# EAGLE board mathlep (EAGLE 4.11)
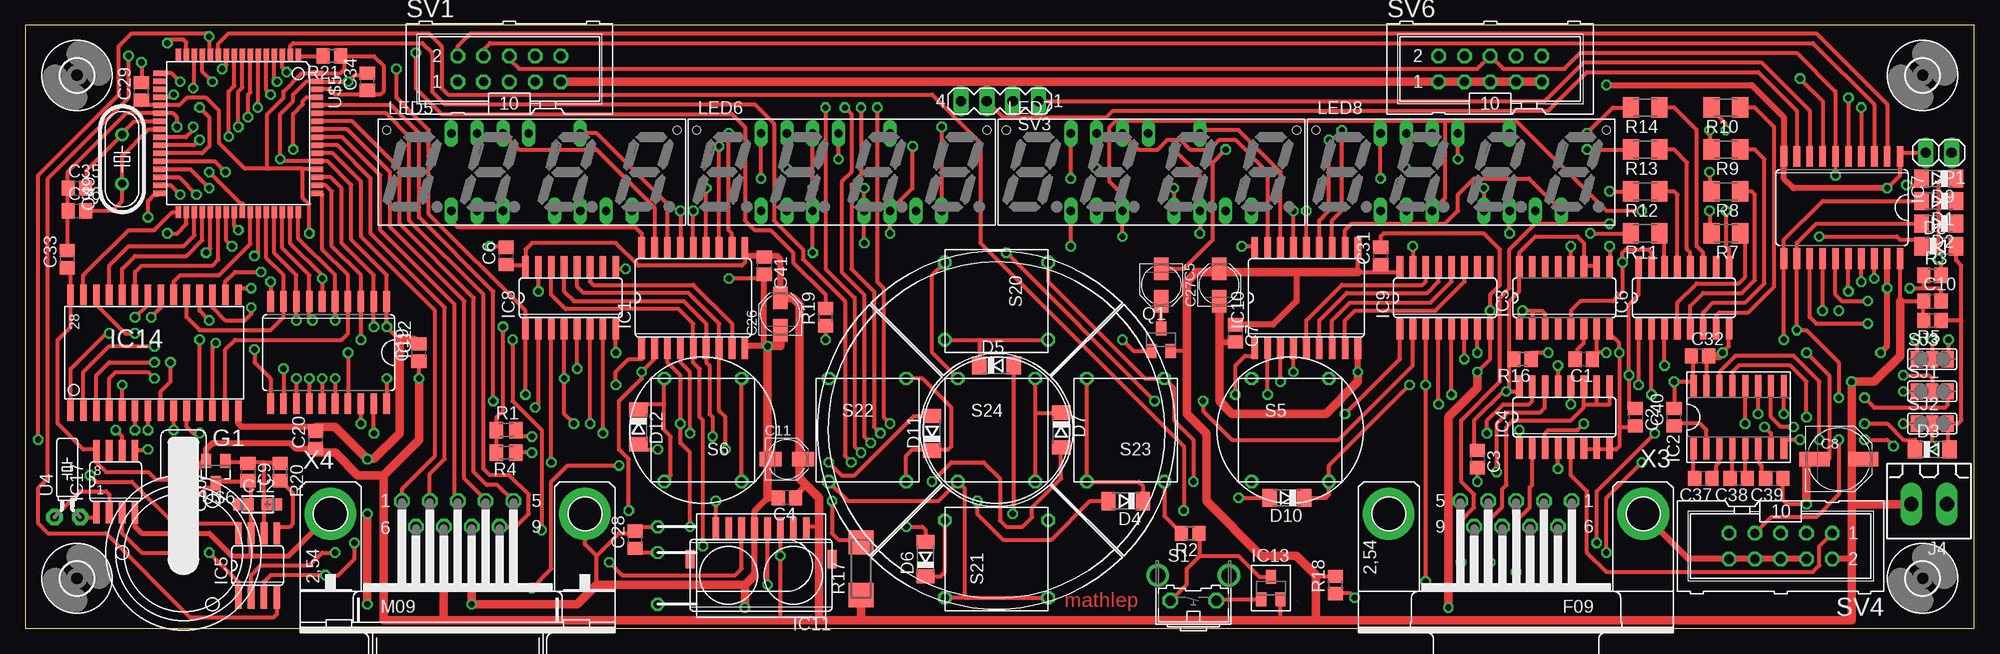
[diagram p3: board, top side]
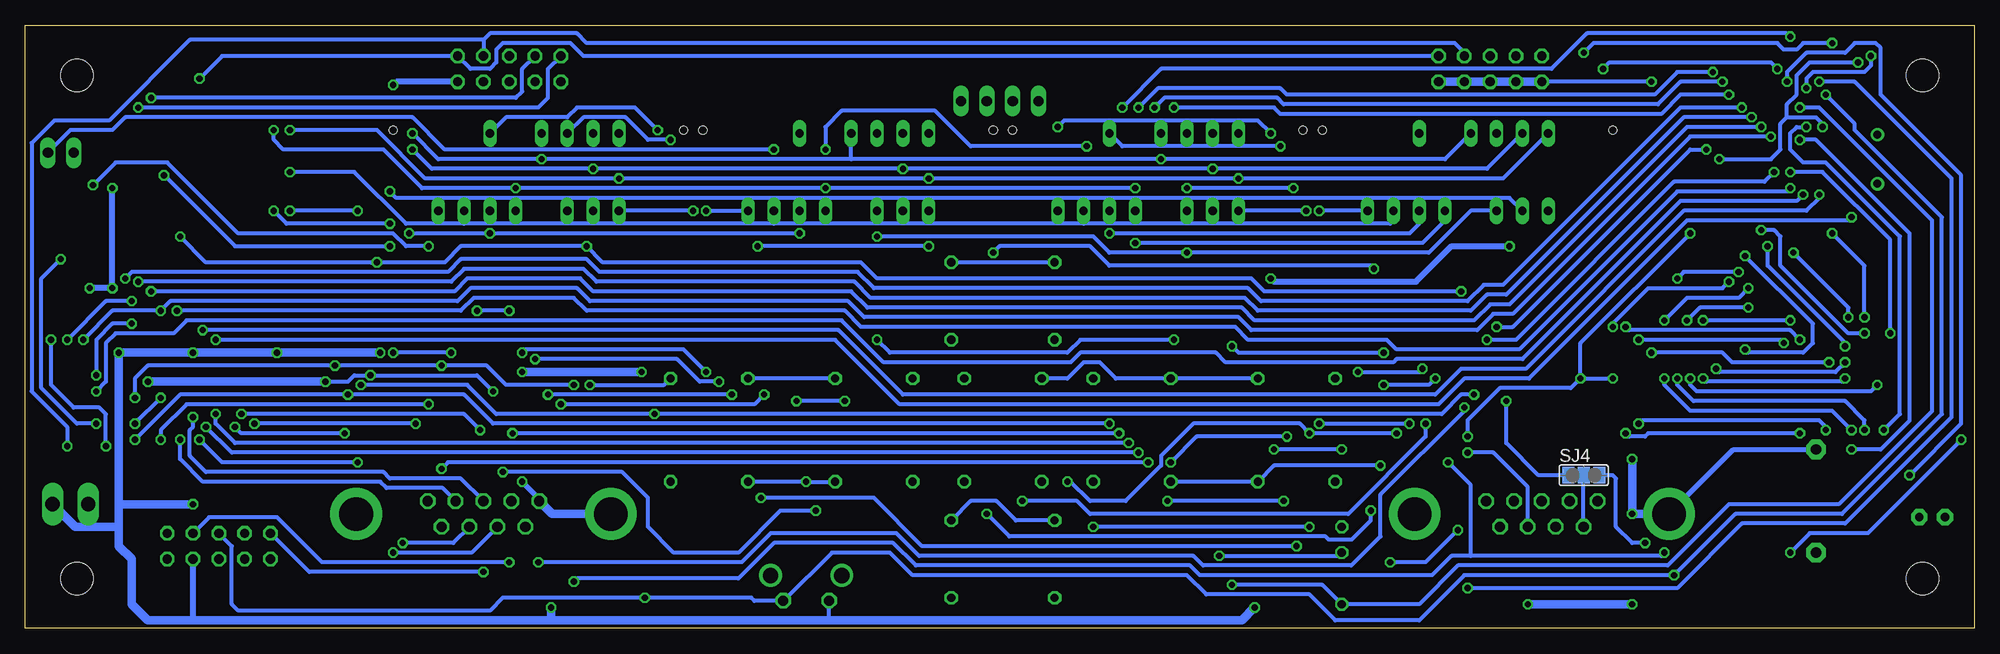
[diagram p4: board, bottom side, seen from below]

Size 191.75 x 59.36 mm. Coordinates in mm from the lower left corner, seen from the top.
Outline: 0,0 191.75,0 191.75,59.36 0,59.36 0,0
Copper layers (1*16): Top 0.035mm / dielectric 1.5mm / Bottom 0.035mm
Design rules "default": minimum track width 10mil, minimum drill 24mil, track to track 8mil, track to pad 8mil, pad to pad 8mil, via to via 8mil, smd to smd 8mil, copper to edge 10mil, drill to drill 8mil, minimum pad ring 10mil, minimum via ring 8mil, stop-mask expansion 4mil, vias tented up to drill 0mil, thermal gap 10mil

## Footprints (pad centres in the part's own frame; a part is rotated, then mirrored left to right if it is on the bottom)
C0805 = smd 1.3 x 1.5: 1 -0.85,0; 2 0.85,0
PANASONIC_B = smd 2.2 x 1.4: + 1.6,0; - -1.6,0
PANASONIC_D = smd 3 x 1.4: + 2.4,0; - -2.4,0
CT3216 = smd 2 x 1.2: + 1.4,0; - -1.4,0
SOD80C = smd 1.4 x 1.8: A 1.7,0; C -1.7,0
BR12XX = drill 1.016 pad 1.93 octagon: + 0,0; - 0,10.16
SO18 = smd 0.66 x 2.032: 1 -4.445,-4.978; 2 -3.175,-4.978; 3 -1.905,-4.978; 4 -0.635,-4.978; 5 0.635,-4.978; 6 1.905,-4.978; 7 3.175,-4.978; 8 4.445,-4.978; 9 5.715,-4.978; 10 5.715,4.978; 11 4.445,4.978; 12 3.175,4.978; 13 1.905,4.978; 14 0.635,4.978; 15 -0.635,4.978; 16 -1.905,4.978; 17 -3.175,4.978; 18 -4.445,4.978
SO16 = smd 0.6 x 2.2: 1 -4.445,-3.073; 2 -3.175,-3.073; 3 -1.905,-3.073; 4 -0.635,-3.073; 5 0.635,-3.073; 6 1.905,-3.073; 7 3.175,-3.073; 9 4.445,3.073; 10 3.175,3.073; 11 1.905,3.073; 12 0.635,3.073; 13 -0.635,3.073; 14 -1.905,3.073; 15 -3.175,3.073; 16 -4.445,3.073 | smd 0.66 x 2.032: 8 4.445,-3.073
SO16' = smd 0.66 x 2.032: 1 -4.445,-3.073; 2 -3.175,-3.073; 3 -1.905,-3.073; 4 -0.635,-3.073; 5 0.635,-3.073; 6 1.905,-3.073; 7 3.175,-3.073; 8 4.445,-3.073; 9 4.445,3.073; 10 3.175,3.073; 11 1.905,3.073; 12 0.635,3.073; 13 -0.635,3.073; 14 -1.905,3.073; 15 -3.175,3.073; 16 -4.445,3.073
SOIC8 = smd 0.66 x 2.184: 1 -1.905,-3.154; 2 -0.645,-3.154; 3 0.625,-3.154; 4 1.895,-3.154; 5 1.905,3.154; 6 0.635,3.154; 7 -0.635,3.154; 8 -1.905,3.154
SO20W = smd 0.66 x 2.032: 1 -5.715,-5.029; 2 -4.445,-5.029; 3 -3.175,-5.029; 4 -1.905,-5.029; 5 -0.635,-5.029; 6 0.635,-5.029; 7 1.905,-5.029; 8 3.175,-5.029; 9 4.445,-5.029; 10 5.715,-5.029; 11 5.715,5.029; 12 4.445,5.029; 13 3.175,5.029; 14 1.905,5.029; 15 0.635,5.029; 16 -0.635,5.029; 17 -1.905,5.029; 18 -3.175,5.029; 19 -4.445,5.029; 20 -5.715,5.029
HSDL1001 = smd 0.66 x 2.032: 1 -4.445,-3.073; 2 -3.175,-3.073; 3 -1.905,-3.073; 4 -0.635,-3.073; 5 0.635,-3.073; 6 1.905,-3.073; 7 3.175,-3.073; 8 4.445,-3.073 | smd 0.914 x 1.778: NC1 -6.985,0; NC2 6.985,0
SOT23 = smd 1 x 1.4: 1 -0.95,-1.1; 2 0.95,-1.1; 3 0,1.1
FP-28 = smd 0.66 x 2.007: 1 -7.62,-5.715; 2 -6.35,-5.715; 3 -5.08,-5.715; 4 -3.81,-5.715; 5 -2.54,-5.715; 6 -1.27,-5.715; 7 0,-5.715; 8 1.27,-5.715; 9 2.54,-5.715; 10 3.81,-5.715; 11 5.08,-5.715; 12 6.35,-5.715; 13 7.62,-5.715; 14 8.89,-5.715; 15 8.89,5.715; 16 7.62,5.715; 17 6.35,5.715; 18 5.08,5.715; 19 3.81,5.715; 20 2.54,5.715; 21 1.27,5.715; 22 0,5.715; 23 -1.27,5.715; 24 -2.54,5.715; 25 -3.81,5.715; 26 -5.08,5.715; 27 -6.35,5.715; 28 -7.62,5.715
SO08 = smd 0.66 x 2.032: 1 -1.905,-3.073; 2 -0.635,-3.073; 3 0.635,-3.073; 4 1.905,-3.073; 5 1.905,3.073; 6 0.635,3.073; 7 -0.635,3.073; 8 -1.905,3.073
180G-2 = drill 1.422 long: 1 -1.75,0; 2 1.75,0
1X02 = drill 1.016 long: 1 -1.27,0; 2 1.27,0
4DIGIT = drill 0.813 long: 1 -7.62,-3.81; 2 -5.08,-3.81; 3 -2.54,-3.81; 4 2.54,-3.81; 5 5.08,-3.81; 6 7.62,-3.81; 7 10.16,-3.81; 8 5.08,3.81; 9 0,3.81; 10 -2.54,3.81; 11 -5.08,3.81; 12 -7.62,3.81 | hole 0.813: -13.97,4.128; 14.605,4.128
SOT23-BEC = smd 1 x 1.4: B -0.95,-1.1; C 0,1.1; E 0.95,-1.1
HC49/S = drill 0.813 round: 1 -2.413,0; 2 2.413,0
M0805 = smd 1.3 x 1.6: 1 -0.95,0; 2 0.95,0
R0805 = smd 1.3 x 1.5: 1 -0.85,0; 2 0.85,0
M1206 = smd 1.6 x 2: 1 -1.4,0; 2 1.4,0
MINI_MELF-0207W = smd 2.4 x 2.5: 1 -2.6,0; 2 2.6,0
B3F-31XX = drill 1.016 octagon: 1 -2.261,-1.245; 2 2.261,-1.245 | drill 1.499 pad 2.159 round: 3 -3.505,1.245; 4 3.505,1.245
MEC1ZC = drill 0.813 octagon: 1 -3.81,5.08; 2 -3.81,-5.08; 3 3.81,5.08; 4 3.81,-5.08
MEC1ZB°45_00 = drill 0.813 octagon: 1 -16.51,5.08; 2 -16.51,-5.08; 3 -8.89,5.08; 4 -8.89,-5.08
SJ_2 = smd 1.168 x 1.6: 1 -1.524,0; 2 0,0; 3 1.524,0
ML10 = drill 0.914 octagon: 1 -5.08,-1.27; 2 -5.08,1.27; 3 -2.54,-1.27; 4 -2.54,1.27; 5 0,-1.27; 6 0,1.27; 7 2.54,-1.27; 8 2.54,1.27; 9 5.08,-1.27; 10 5.08,1.27
MA04-1 = drill 1.016 long: 1 -3.81,0; 2 -1.27,0; 3 1.27,0; 4 3.81,0
TC26H = drill 0.813 pad 1.6 octagon: 1 -1.27,0; 2 1.27,0
3,2 = hole 3.2: 0,0
TQFP64 = smd 1.194 x 0.559: 1 -7.76,5.905; 2 -7.76,5.118; 3 -7.76,4.331; 4 -7.76,3.543; 5 -7.76,2.756; 6 -7.76,1.968; 7 -7.76,1.181; 8 -7.76,0.394; 9 -7.76,-0.394; 10 -7.76,-1.181; 11 -7.76,-1.968; 12 -7.76,-2.756; 13 -7.76,-3.543; 14 -7.76,-4.331; 15 -7.76,-5.118; 16 -7.76,-5.905; 33 7.76,-5.905; 34 7.76,-5.118; 35 7.76,-4.331; 36 7.76,-3.543; 37 7.76,-2.756; 38 7.76,-1.968; 39 7.76,-1.181; 40 7.76,-0.394; 41 7.76,0.394; 42 7.76,1.181; 43 7.76,1.968; 44 7.76,2.756; 45 7.76,3.543; 46 7.76,4.331; 47 7.76,5.118; 48 7.76,5.905 | smd 0.559 x 1.194: 17 -5.905,-7.76; 18 -5.118,-7.76; 19 -4.331,-7.76; 20 -3.543,-7.76; 21 -2.756,-7.76; 22 -1.968,-7.76; 23 -1.181,-7.76; 24 -0.394,-7.76; 25 0.394,-7.76; 26 1.181,-7.76; 27 1.968,-7.76; 28 2.756,-7.76; 29 3.543,-7.76; 30 4.331,-7.76; 31 5.118,-7.76; 32 5.905,-7.76; 49 5.905,7.76; 50 5.118,7.76; 51 4.331,7.76; 52 3.543,7.76; 53 2.756,7.76; 54 1.968,7.76; 55 1.181,7.76; 56 0.394,7.76; 57 -0.394,7.76; 58 -1.181,7.76; 59 -1.968,7.76; 60 -2.756,7.76; 61 -3.543,7.76; 62 -4.331,7.76; 63 -5.118,7.76; 64 -5.905,7.76
IR-TSOP- = drill 0.61 pad 1.27 octagon: 1 -2.54,0; 2 0,0; 3 5.08,0
F09HP = drill 1.016 octagon: 1 -5.486,-1.27; 2 -2.743,-1.27; 3 0,-1.27; 4 2.743,-1.27; 5 5.486,-1.27; 6 -4.115,1.27; 7 -1.372,1.27; 8 1.372,1.27; 9 4.115,1.27 | drill 3.302 pad 5.08 round: G1 -12.522,0; G2 12.522,0
M09HP = drill 1.016 octagon: 1 -5.486,1.27; 2 -2.743,1.27; 3 0,1.27; 4 2.743,1.27; 5 5.486,1.27; 6 -4.115,-1.27; 7 -1.372,-1.27; 8 1.372,-1.27; 9 4.115,-1.27 | drill 3.302 pad 5.08 round: G1 -12.522,0; G2 12.522,0

## Placement (x,y rotation side)
C1  1u  [C0805]  153.35,26.5 180 top
C2  100n  [C0805]  158.43,20.79 270 top
C3  100n  [C0805]  142.87,16.66 270 top
C4  100n  [C0805]  74.92,12.85 180 top
C5  10u  [PANASONIC_B]  111.75,33.81 270 top
C6  100n  [C0805]  47.3,36.66 90 top
C7  100n  [C0805]  119.06,29.04 270 top
C8  [PANASONIC_D]  178.43,16.66 0 top
C9  1u  [C0805]  21.9,15.39 270 top
C10  100n  [C0805]  187.64,32.22 0 top
C11  10u  [PANASONIC_B]  74.92,16.66 0 top
C12  4.7u/10V/3216  [CT3216]  22.86,12.22 0 top
C19  100n  [C0805]  38.73,27.14 90 top
C20  100n  [C0805]  28.57,18.57 90 top
C26  10u  [PANASONIC_B]  74.29,30.95 90 top
C27  10u  [PANASONIC_B]  117.47,33.81 90 top
C28  100n  [C0805]  60,8.73 90 top
C29  100n  [C0805]  11.43,52.86 90 top
C30  100n  [C0805]  15.55,13.81 270 top
C31  100n  [C0805]  133.34,36.66 90 top
C32  100n  [C0805]  164.78,26.82 0 top
C33  100n  [C0805]  4.12,36.35 90 top
C34  100n  [C0805]  33.65,53.81 90 top
C35  [C0805]  5.08,43.33 0 top
C36  [C0805]  5.08,41.11 0 top
C37  100n  [C0805]  165.09,14.76 180 top
C38  100n  [C0805]  168.59,14.76 180 top
C39  100n  [C0805]  172.08,14.76 180 top
C40  100n  [C0805]  162.24,20.79 90 top
C41  100n  [C0805]  72.7,35.71 270 top
D1  [SOD80C]  188.27,42.06 180 top
D2  [SOD80C]  188.27,39.84 180 top
D3  [SOD80C]  187.64,17.61 0 top
D4  [SOD80C]  108.26,12.54 180 top
D5  [SOD80C]  95.56,25.87 0 top
D6  [SOD80C]  88.58,6.82 90 top
D7  [SOD80C]  101.91,19.52 270 top
D8  [SOD80C]  188.27,37.62 0 top
D9  [SOD80C]  188.27,44.28 180 top
D10  [SOD80C]  124.14,12.85 180 top
D11  [SOD80C]  89.21,19.2 90 top
D12  [SOD80C]  60.32,19.84 270 top
G1  3V Lithium  [BR12XX]  15.55,7.46 0 top
IC1  ULN2803A  [SO18]  65.08,32.54 0 top
IC2  MAX202ECWED  [SO16]  168.59,20.79 0 top
IC3  74LS123D  [SO16']  151.44,32.54 0 top
IC4  4053D  [SO16']  151.44,20.79 0 top
IC5  AT45DB0X1  [SOIC8]  22.86,6.18 0 top
IC6  4094D  [SO16']  163.19,32.54 0 top
IC7  74LS245DW  [SO20W]  178.75,41.43 180 top
IC8  4094D  [SO16']  53.65,32.54 0 top
IC9  4094D  [SO16']  139.69,32.54 0 top
IC10  ULN2803A  [SO18]  125.41,32.54 0 top
IC11  HSDL1001  [HSDL1001]  72.38,6.82 180 top
IC12  74HC573D  [SO20W]  29.84,27.14 180 top
IC13  DS1811  [SOT23]  122.55,3.96 0 top
IC14  43256AC  [FP-28]  12.06,27.14 0 top
IC17  DS1307  [SO08]  8.89,14.44 0 top
J4  [180G-2]  187.32,12.22 180 top
JP1  [1X02]  188.27,46.82 180 top
LED5  4DIGIT-C  [4DIGIT]  49.53,44.92 0 top
LED6  4DIGIT-C  [4DIGIT]  80,44.92 0 top
LED7  4DIGIT-C  [4DIGIT]  110.48,44.92 0 top
LED8  4DIGIT-C  [4DIGIT]  140.97,44.92 0 top
Q1  BC857  [SOT23-BEC]  111.75,28.41 0 top
Q49  [HC49/S]  9.52,46.19 90 top
R1  NTC 10k  [M0805]  47.3,19.52 0 top
R2  4k7  [R0805]  114.61,9.36 180 top
R3  4k7  [R0805]  187.64,34.76 0 top
R4  4k7  [M0805]  47.3,17.3 180 top
R5  4k7  [R0805]  187.64,30.31 180 top
R7  33  [M1206]  167.32,38.89 180 top
R8  33  [M1206]  167.32,43.02 180 top
R9  33  [M1206]  167.32,47.14 180 top
R10  33  [M1206]  167.32,51.27 180 top
R11  33  [M1206]  159.38,38.89 180 top
R12  33  [M1206]  159.38,43.02 180 top
R13  33  [M1206]  159.38,47.14 180 top
R14  33  [M1206]  159.38,51.27 180 top
R16  160k  [R0805]  147.31,26.5 180 top
R17  9e1  [MINI_MELF-0207W]  82.23,5.87 90 top
R18  4k7  [R0805]  128.9,4.28 90 top
R19  2k2  [R0805]  78.73,30.63 90 top
R20  100k  [R0805]  25.08,15.39 270 top
R21  4k7  [R0805]  30.16,56.35 180 top
S1  Reset  [B3F-31XX]  114.93,3.96 0 top
S5  [MEC1ZC]  124.45,19.52 0 top
S6  [MEC1ZC]  66.67,19.52 180 top
S20  [MEC1ZB°45_00]  95.56,19.52 270 top
S21  [MEC1ZB°45_00]  95.56,19.52 90 top
S22  [MEC1ZB°45_00]  95.56,19.52 0 top
S23  [MEC1ZB°45_00]  95.56,19.52 180 top
S24  [MEC1ZC]  95.56,19.52 0 top
SJ1  [SJ_2]  187.64,23.33 0 top
SJ2  [SJ_2]  187.64,20.15 0 top
SJ3  [SJ_2]  187.64,26.5 0 top
SJ4  [SJ_2]  38.41,15.08 0 bottom
SV1  [ML10]  47.62,55.08 0 top
SV3  [MA04-1]  95.88,51.91 180 top
SV4  [ML10]  172.72,8.09 180 top
SV6  [ML10]  144.14,55.08 0 top
U4  32kHz  [TC26H]  4.12,10.95 0 top
U$1  [3,2]  5.08,4.92 0 top
U$2  [3,2]  186.69,4.92 0 top
U$3  [3,2]  186.69,54.45 0 top
U$4  [3,2]  5.08,54.45 0 top
U$5  MEGA64-A  [TQFP64]  20.95,48.73 270 top
U$6  XC6202PMR  [SOT23]  18.73,15.39 180 top
U$7  IR-TSOP-  [IR-TSOP-]  62.23,7.46 270 top
X3  [F09HP]  146.68,11.27 180 top
X4  [M09HP]  42.54,11.27 0 top

## Tracks (layer width: path | path; a pad name or v marks a point on that pad's centre or on a via)
+3V3
  Top 0.406: 23.49,16.34 21.9,16.34 | U$6.1 19.68,16.34 21.9,16.34 | 21.9,16.34 C9.1 | 23.49,12.22 C12.+ | IC5.6 23.49,12.22 | 23.49,12.22 23.49,16.34 | R20.1 25.08,16.34 23.49,16.34
+5V  (via drill 0.61, 0.81)
  Top 0.406: v38.73,24.6 C19.1 | 23.81,45.24 23.81,50.63 25.39,52.22 25.39,52.86 27.17,54.64 U$5.64 30.98,54.64 31.43,55.08 31.43,56.35 R21.1 34.29,56.35 35.24,55.4 35.24,52.86 34.92,52.54 33.65,52.54 | 23.81,45.24 21.58,45.24 19.04,47.78 19.04,50.95 17.77,52.22 15.87,52.22 15.13,51.49 U$5.21 11.43,51.49 C29.1 | 6.98,17.61 IC17.8 | 6.98,17.61 5.71,17.61 3.17,20.15 3.17,28.41 4.44,29.68 IC14.28 4.44,35.39 4.23,35.39 C33.1 | 6.98,17.61 6.98,16.34 7.93,15.39 12.06,15.39 12.8,14.66 C30.1 | v27.93,38.89 27.93,41.74 27.3,42.38 27.3,45.24 | 27.3,45.24 23.81,45.24 | U$5.52 28.66,45.24 27.3,45.24 | IC11.3 v74.29,7.14 74.29,0.79 | 76.19,16.66 C11.+ | 70.8,37.62 IC1.10 70.8,36.03 70.48,35.71 60.32,35.71 58.1,37.94 49.84,37.94 49.21,37.3 IC8.16 49.21,35.71 47.3,35.71 C6.1 | R17.1 82.23,2.38 | IC13.2 123.5,3.01 | IC13.2 | 123.5,0.79 IC13.2 | 41.27,0.79 41.17,0.89 | v35.55,24.6 IC12.20 | IC10.10 131.12,35.08 133.34,35.08 | 135.25,35.71 IC9.16 135.25,35.08 133.34,35.08 | 146.04,26.5 146.04,32.22 147,33.17 IC3.16 147,36.98 148.59,38.57 152.71,38.57 153.35,37.94 153.35,35.71 | 153.35,35.39 IC3.11 153.35,35.71 | IC6.16 158.75,32.85 157.79,31.9 v157.79,24.92 157.79,21.64 C2.1 | R18.2 127.1,5.13 126.99,5.23 | U$5.62 29.95,53.06 30.47,52.54 33.65,52.54 | IC4.16 147,23.96 | IC11.1 76.83,10 78.1,10 | IC4.16 147,23.65 | IC4.16 147,23.33 146.04,23.33 | 146.04,23.33 v145.73,23.33 145.41,23.33 142.55,20.47 142.55,17.93 142.87,17.93 C3.1 | 146.04,26.5 R16.2 | 146.04,23.33 146.04,26.5 | C32.1 164.14,26.82 IC2.16 164.14,24.28 v162.24,24.28 C40.2 | 33.65,52.54 C34.1 | R1.2 48.25,18.88 v49.84,18.88 | 186.69,32.22 184.46,32.22 IC7.20
  Top 0.406: 186.69,32.22 C10.1 | R5.2 186.69,30.31 186.69,32.22 | Q1.E 114.3,27.31 114.3,27.46 | IC3.10 154.62,35.71 153.35,35.71 | 133.34,35.08 C31.1 | C28.1 60,7.46 U$7.2 | 179.7,16.66 C8.+ | C20.1 28.57,17.3
  Top 0.61: IC1.10 70.8,36.66 72.7,36.66 | 72.7,36.66 C41.1 | 72.7,36.66 73.97,36.66 74.29,36.35 C26.+ 74.29,32.54 | C7.1 122.77,29.89 125.09,32.22 125.09,35.08 | 179.7,6.82 SV4.2 | C20.1 26.56,17.72 26.03,18.25 18.41,18.25 17.78,17.62 U$6.2 17.61,16.49 15.77,14.66 C30.1 | C4.1 75.77,13.07 76.83,14.12
  Top 0.813: 28.57,17.3 30.47,17.3 32.7,15.08 35.24,15.08 | 35.24,15.08 38.73,18.57 v38.73,24.6 | 82.23,0.79 R17.1 | 82.23,0.79 123.5,0.79 126.99,0.79 | 41.17,0.89 X4.7 | 78.1,0.79 74.29,0.79 41.27,0.79 35.24,0.79 35.24,15.08 | 78.1,0.79 82.23,0.79 | 78.1,0.79 78.1,10 78.1,12.85 76.83,14.12 76.19,14.76 76.19,16.66 76.19,31.9 75.56,32.54 74.29,32.54 | 126.99,0.79 126.99,5.23 125.09,7.14 121.6,7.14 116.2,12.54 116.2,19.2 114.3,21.11 114.3,27.46 114.3,34.12 115.25,35.08 117.47,35.08 | 179.7,12.22 179.7,6.82 179.7,0.79 126.99,0.79 | 179.7,12.22 179.7,16.66 v179.7,24.28 181.92,24.28 184.46,26.82 184.46,32.22 | 117.47,35.08 125.09,35.08 131.12,35.08 | 117.47,35.08 C27.+ | 179.7,12.22 J4.2
  Bottom 0.406: v38.73,24.6 v35.55,24.6 | U$7.2 62.54,7.14 v74.29,7.14 | v162.24,24.28 160.01,24.28 159.38,24.92 v157.79,24.92 147.31,24.92 v145.73,23.33 | v49.84,18.88 49.84,20.47 46.67,23.65 39.68,23.65 v38.73,24.6 | v27.93,38.89 38.73,28.09 v38.73,24.6
  Bottom 0.813: v179.7,24.28 v162.24,24.28
  other vias: 62.23,7.46
A8
  Top 0.406: IC14.25 8.25,35.71 10.16,37.62 15.55,37.62 16.62,38.68 U$5.35
A9
  Top 0.406: IC14.24 9.52,35.39 10.79,36.66 15.87,36.66 17.41,38.2 U$5.36
A10  (via drill 0.61)
  Top 0.406: IC14.21 13.33,31.58 v12.38,30.63 | U$5.37 18.19,37.4 v17.77,36.98
  Bottom 0.406: v12.38,30.63 12.38,31.58 v17.77,36.98
A11
  Top 0.406: IC14.23 10.79,35.08 11.43,35.71 18.41,35.71 18.98,36.28 U$5.38
A12  (via drill 0.61)
  Top 0.406: v12.7,27.77 8.25,27.77 5.71,25.23 IC14.2 | U$5.39 19.77,38.16 v20.31,37.62
  Bottom 0.406: v20.31,37.62 20.31,35.71 12.7,28.09 v12.7,27.77
A13  (via drill 0.61)
  Top 0.406: IC14.26 6.98,31.9 9.84,29.04 v10.79,29.04 | U$5.40 20.56,39.6 v20.95,39.2
  Bottom 0.406: v10.79,29.04 12.38,29.04 19.04,35.71 19.04,38.57 19.68,39.2 v20.95,39.2
A14  (via drill 0.61)
  Top 0.406: IC14.1 4.44,25.55 7.93,29.04 v8.25,29.04 | U$5.41 21.34,41.82 21.19,41.82 v18.09,44.92
  Bottom 0.406: v18.09,44.92 14.92,44.92 8.25,38.25 v8.25,29.04
A15
  Top 0.406: IC14.20 14.6,34.12 15.24,34.76 19.04,34.76 22.13,37.85 U$5.42
AD0  (via drill 0.61)
  Top 0.406: U$5.51 30.04,44.4 31.11,43.33 31.11,37.94 34.29,34.76 IC12.2 v34.29,29.68 | IC14.11 v17.14,28.41
  Bottom 0.406: v34.29,29.68 33.97,29.36 18.09,29.36 v17.14,28.41
AD1  (via drill 0.61)
  Top 0.406: U$5.50 29.56,43.61 30.16,43.02 30.16,37.62 33.02,34.76 IC12.3 v33.02,28.41 | IC14.12 18.41,27.77 v18.73,28.09
  Bottom 0.406: v33.02,28.41 19.04,28.41 v18.73,28.09
AD2
  Top 0.406: IC14.13 19.68,27.46 20.63,28.41 31.11,28.41 31.74,29.04 IC12.4 31.74,34.76 29.2,37.3 29.2,42.7 29.08,42.82 U$5.49
AD3  (via drill 0.61)
  Top 0.406: U$5.48 26.86,38.38 30.47,34.76 IC12.5 v30.47,30.31 | IC14.15 20.95,33.49 v22.22,33.49
  Bottom 0.406: v22.22,33.49 23.17,32.54 28.25,32.54 v30.47,30.31
AD4  (via drill 0.61)
  Top 0.406: U$5.47 26.07,37.9 29.2,34.76 v29.2,34.44 IC12.6 | IC14.16 19.68,34.12 20.63,35.08 v23.17,35.08
  Bottom 0.406: v23.17,35.08 28.57,35.08 v29.2,34.44
AD5  (via drill 0.61)
  Top 0.406: U$5.46 25.28,37.41 27.93,34.76 IC12.7 27.93,30.63 v28.25,30.31 | IC14.17 18.41,31.58 19.68,30.31 21.58,30.31 22.22,30.95 v22.22,31.58
  Bottom 0.406: v22.22,31.58 26.98,31.58 v28.25,30.31
AD6  (via drill 0.61)
  Top 0.406: U$5.45 24.49,36.93 26.66,34.76 IC12.8 v26.66,30.31 | IC14.18 17.14,31.27 v18.09,30.31
  Bottom 0.406: v18.09,30.31 v26.66,30.31
AD7
  Top 0.406: U$5.44 23.71,36.45 25.39,34.76 IC12.9 25.39,30.63 24.12,29.36 17.14,29.36 15.87,30.63 IC14.19
COL0
  Top 0.406: IC1.18 60.64,38.89 60,39.52 42.54,39.52 41.91,40.16 LED5.1
COL1
  Top 0.406: LED5.10 48.57,47.14 56.19,47.14 61.91,41.43 IC1.17
COL2
  Top 0.406: IC1.16 63.18,41.74 56.19,48.73 LED5.8
COL3  (via drill 0.61)
  Top 0.406: v64.45,41.11 IC1.15
  Bottom 0.406: LED5.7 v64.45,41.11
COL4  (via drill 0.61)
  Top 0.406: IC1.14 v65.72,41.11
  Bottom 0.406: v65.72,41.11 LED6.1
COL5  (via drill 0.61)
  Top 0.406: IC1.13 v66.99,43.33 | v77.46,43.33 LED6.10
  Bottom 0.406: v66.99,43.33 v77.46,43.33
COL6  (via drill 0.61)
  Top 0.406: IC1.12 v68.26,47.46
  Bottom 0.406: v68.26,47.46 83.81,47.46 LED6.8
COL7  (via drill 0.61)
  Top 0.406: IC1.11 69.53,38.89 69.21,39.2 v69.21,48.73 | v90.16,49.37 LED6.7
  Bottom 0.406: LED6.7 90.16,41.43 | v69.21,48.73 70.48,50 89.53,50 v90.16,49.37
COL8  (via drill 0.61)
  Top 0.406: v102.86,37.62 LED7.1 | IC10.18 120.96,37.62 v119.69,37.62
  Bottom 0.406: v102.86,37.62 v119.69,37.62
COL9
  Top 0.406: IC10.17 122.23,44.92 119.06,48.09 117.47,48.09 116.52,47.14 114.61,47.14 113.66,48.09 112.39,48.09 111.44,47.14 109.53,47.14 LED7.10
COL10
  Top 0.406: IC10.16 123.5,44.92 119.38,49.05 115.88,49.05 LED7.8
COL11  (via drill 0.61)
  Top 0.406: IC10.15 v124.77,41.11
  Bottom 0.406: v124.77,41.11 LED7.7
COL12  (via drill 0.61)
  Top 0.406: IC10.14 v126.04,41.11
  Bottom 0.406: v126.04,41.11 LED8.1
COL13  (via drill 0.61)
  Top 0.406: IC10.13 127.31,40.16 128.27,41.11 v128.27,48.09
  Bottom 0.406: v128.27,48.09 130.49,48.09 132.71,50.32 136.84,50.32 LED8.10
COL14  (via drill 0.61)
  Top 0.406: IC10.12 128.58,40.16 129.53,41.11 v129.53,49.05
  Bottom 0.406: LED8.8 144.46,50.32 138.42,50.32 137.47,51.27 131.76,51.27 v129.53,49.05
COL15
  Top 0.406: IC10.11 129.85,39.2 130.49,39.84 139.69,39.84 140.97,41.11 140.97,42.7 142.55,44.28 147.95,44.28 LED8.7
DISPEN  (via drill 0.61)
  Top 0.406: v136.52,37.62 IC9.15 | IC3.5 152.08,31.27 153.03,32.22 156.2,32.22 157.16,33.17 v157.16,36.03 157.16,36.98 157.47,37.3 159.7,37.3 160.01,36.98 IC6.15 | D8.C 186.57,38.25 184.46,38.25 184.14,38.57 v176.53,38.57 | v50.48,33.17 IC8.15
  Bottom 0.406: 157.79,36.03 150.49,36.03 148.9,37.62 v136.52,37.62 134.93,36.03 109.53,36.03 107.94,34.44 71.11,34.44 69.84,33.17 v50.48,33.17 | 157.79,36.03 v157.16,36.03 | 157.79,36.03 173.98,36.03 v176.53,38.57
GND  (via drill 0.61, 0.81)
  Top 0.406: 38.31,28.41 C19.2 | v183.19,43.33 184.46,44.6 IC7.1 184.46,46.82 JP1.2 | 70.8,27.77 IC1.9 | 56.19,4.28 56.19,7.14 | 56.19,7.14 58.41,9.36 60,9.36 | v58.1,27.14 IC8.8 | IC13.3 121.45,5.06 119.38,7.14 115.56,7.14 | 115.56,7.14 114.3,5.87 114.3,4.34 S1.1 | R2.1 115.56,9.26 115.56,7.14 | v24.12,34.12 IC12.10 | IC3.1 147,30.95 v147.31,31.27 148.27,31.27 | 148.27,31.27 149.22,31.27 149.54,30.95 IC3.3 | 148.27,31.27 IC3.2 | IC4.6 153.35,17.61 154.62,17.61 | 155.89,17.61 IC4.8 | 154.62,17.61 IC4.7 | 155.89,17.61 154.62,17.61 | 156.84,19.84 v156.84,27.14 156.84,28.09 156.2,28.73 155.89,28.73 IC3.8 | 156.84,19.84 156.84,17.93 156.52,17.61 155.89,17.61 | 60,9.36 C28.2 | X4.G2 55.06,8.27 56.19,7.14 | IC2.15 165.41,26.82 165.73,26.82 | C39.1 172.93,12.64 173.35,12.22 v175.25,12.22 | v175.25,27.14 177.48,24.92 177.48,16.66 C8.- | IC6.8 167.63,27.77 v167,27.14 | v14.92,49.37 14.92,50.32 14.54,50.7 U$5.22 9.9,50.7 4.12,44.92 4.12,43.33 | 4.12,41.11 C36.1 | 4.12,43.33 C35.1 | 4.12,43.33 4.12,41.11 | 4.12,41.11 C33.2 | 36.83,28.41 v35.55,29.68 IC12.1 35.55,34.76 32.06,38.25 32.06,43.65 29.74,45.97 U$5.53 25.29,45.97 v25.08,46.19 25.08,50.63 26.35,51.91 26.35,52.54 27.66,53.85 U$5.63 28.75,53.81 v31.74,53.81 32.38,54.45 33.65,54.45 C34.2 | v49.84,17.3 R4.1 | C10.2 188.49,33.27 188.27,33.49 186.79,33.49 | v11.43,55.71 C29.2 | 186.79,33.49 R3.1 | v185.41,33.49 186.79,33.49 | 117.47,28.41 117.47,28.2 | C6.2 47.3,37.62 v45.72,37.62 | 72.7,34.44 v69.21,34.44 | C31.2 133.34,38.57 133.66,38.89 143.5,38.89 145.09,37.3 145.09,33.81 144.14,32.85 v144.14,31.27 IC9.8 144.14,26.5 v142.87,25.23 | 156.84,19.84 156.84,19.94 | 60,9.36 60,10 U$7.1
  Top 0.406: v142.87,14.44 C3.2 | C2.2 158.43,19.84 156.84,19.84 | IC7.10 173.03,46.51 | C9.2 22.22,14.54 22.22,14.44 | 22.22,14.44 18.73,14.44 18.73,14.12 | C30.2 16.93,12.96 17.77,13.81 18.73,13.81 18.73,14.12 | 18.73,14.12 U$6.3 | 28.57,19.84 C20.2 | 22.22,12.22 C12.- | 22.22,12.22 22.22,14.44 | IC5.7 22.22,12.22 | 73.02,16.66 C11.-
  Top 0.508: 22.22,7.14 20.31,7.14 18.09,9.36 11.43,9.36 10.79,10 IC17.4 | 22.22,7.14 IC5.7 | X4.G1 25.89,7.14 22.22,7.14
  Top 0.61: v183.19,43.33 173.98,43.33 173.03,44.28 IC7.10 | v73.02,27.77 72.7,27.77 | 72.7,27.77 70.8,27.77 | 71.75,5.23 IC11.5 71.75,11.58 73.02,12.85 C4.2 | v131.12,25.23 IC10.9 | v182.56,27.14 183.19,27.77 v183.19,33.49 IC7.19 | IC14.14 20.95,20.15 21.27,19.84 28.57,19.84 | 72.7,27.77 72.7,34.44 C41.2 | 117.47,28.2 C7.2 | v155.57,53.49 169.86,53.49 173.03,50.32 173.03,46.82 | 92.07,53.81 SV3.4 | 97.15,53.81 SV3.2 | SV4.4 SV4.6 SV4.8 SV4.10 163.65,6.82 X3.G1
  Top 0.813: 38.31,28.41 36.83,28.41 36.83,19.2 34.29,16.66 v33.65,16.66 30.47,19.84 28.57,19.84 | SV6.9 SV6.7 SV6.5 SV6.3 SV6.1 97.15,53.81 92.07,53.81 SV1.9 | 70.8,4.28 71.75,5.23 | 70.8,4.28 56.19,4.28 54.29,2.38 v43.91,2.38 X4.8 | 70.8,4.28 v70.8,2.06 | C27.- 117.47,28.41 117.47,22.38 118.74,21.11 127.95,21.11 131.12,24.28 v131.12,25.23 | C32.2 165.73,26.82 166.68,26.82 v167,27.14 | v33.65,11.27 v33.65,2.38 | C26.- 74.29,27.77 v73.02,27.77 73.02,16.66 73.02,12.85 | v142.87,25.23 142.87,23.65 140.01,20.79 140.01,12.54 | 140.01,12.54 X3.5 | v140.01,2.06 140.01,12.54 | v175.25,12.22 175.25,16.66
  Bottom 0.406: v14.92,49.37 14.92,49.68 15.55,50.32 18.41,50.32 | 18.41,50.32 19.04,49.68 19.04,47.14 20,46.19 v25.08,46.19 | v24.12,34.12 24.76,33.49 32.06,33.49 35.55,30 v35.55,29.68 | v73.02,27.77 72.38,27.14 v58.1,27.14 | 112.67,0.83 112.71,0.79 112.67,0.79 S1.1 | v31.74,53.81 SV1.1 | v144.14,31.27 v147.31,31.27 | v49.84,17.3 47.3,17.3 43.91,13.91 X4.8 | v11.43,55.71 16.19,55.71 17.46,54.45 17.46,52.54 18.41,51.59 18.41,50.32
  Bottom 0.508: X4.G1 23.67,17.61 G1.- | X3.5 141.19,12.76 v142.87,14.44
  Bottom 0.61: v183.19,43.33 v183.19,33.49 v185.41,33.49 | v45.72,37.62 51.43,37.62 54.92,34.12 68.89,34.12 v69.21,34.44 | SV6.9 155.25,53.81 v155.57,53.49 | 175.25,0.79 SV4.4
  Bottom 0.813: SV1.9 SV1.7 SV1.5 SV1.3 SV1.1 | v70.8,2.06 72.07,0.79 112.71,0.79 140.01,0.79 | 140.01,0.79 v140.01,2.06 | v142.87,25.23 v131.12,25.23 | v156.84,27.14 v167,27.14 v175.25,27.14 v182.56,27.14 182.56,12.22 | 140.01,0.79 175.25,0.79 179.7,0.79 181.29,2.38 181.29,6.82 182.56,8.09 182.56,10 | 182.56,10 182.56,12.22 | v33.65,16.66 v33.65,11.27 X4.G1 | v33.65,2.38 v43.91,2.38 | J4.1 186.85,10 182.56,10 | 182.56,12.22 v175.25,12.22 | X3.5 139.92,11.27 X3.G2
  other vias: 62.23,10
GREEN0
  Top 0.406: SV1.4 45.08,56.98 45.72,57.62 175.89,57.62 181.92,51.59 IC7.3
GREEN1  (via drill 0.61)
  Top 0.406: v179.38,52.22 IC7.5
  Bottom 0.406: SV6.4 142.87,55.08 142.87,52.86 143.5,52.22 v179.38,52.22
LEDCLK  (via drill 0.61)
  Top 0.406: SV1.6 47.62,56.03 48.57,55.08 142.87,55.08 SV6.6 145.41,55.08 151.44,55.08 153.03,56.67 174.3,56.67 178.11,52.86 178.11,46.51 | v155.89,37.62 IC3.9 | 178.11,46.51 IC7.6 | 178.11,46.51 v178.11,44.6
  Bottom 0.406: v155.89,37.62 171.13,37.62 v178.11,44.6
LEDOE  (via drill 0.61)
  Top 0.406: v187.64,17.93 SJ2.2
  Bottom 0.406: SV1.8 50.16,56.67 51.11,57.62 136.52,57.62 137.47,58.57 146.04,58.57 146.68,57.94 | 146.68,57.94 SV6.8 | 146.68,57.94 175.57,57.94 183.51,50 188.91,50 191.13,47.78 191.13,23.33 187.64,19.84 v187.64,17.93
LEDRESET  (via drill 0.61)
  Top 0.406: IC7.7 176.84,51.91 v174.62,54.13
  Bottom 0.406: SV1.10 136.84,56.35 138.11,57.62 144.78,57.62 145.41,56.98 145.41,55.71 146.04,55.08 147.95,55.08 SV6.10 172.4,56.35 v174.62,54.13
MISO  (via drill 0.61)
  Top 0.406: U$5.13 17.41,54.81 v18.41,53.81 | v6.34,15.08 6.98,14.44 10.47,14.44 14.6,10.31 20.95,10.31 IC5.8
  Bottom 0.406: v6.34,15.08 1.27,20.15 1.27,44.6 9.2,52.54 9.2,57.14 9.68,57.62 11.74,57.62 12.7,56.67 16.5,56.67 18.41,54.76 v18.41,53.81
MOSI  (via drill 0.61)
  Top 0.406: v1.27,18.57 1.27,44.6 9.2,52.54 9.2,57.3 10.47,58.57 17.77,58.57 v18.09,58.25 18.09,56.49 U$5.12 | v83.81,51.27 83.81,34.12 84.45,33.49 84.45,20.79 v85.08,20.15 | v160.01,23.01 IC6.2 | v180.97,18.57 183.19,18.57 v183.83,17.93 | SJ3.3 189.22,26.5 v189.22,28.41 | IC5.1 20.95,4.6 v18.09,7.46
  Bottom 0.406: v83.81,51.27 80,55.08 41.59,55.08 38.1,58.57 18.41,58.57 v18.09,58.25 | v85.08,20.15 145.73,20.15 148.59,23.01 v160.01,23.01 176.53,23.01 v180.97,18.57 | v183.83,17.93 183.83,21.11 184.46,21.74 187,21.74 189.22,23.96 v189.22,28.41 | v1.27,18.57 10.47,9.36 16.19,9.36 v18.09,7.46
N$1
  Top 0.406: U$5.23 10.7,49.91 9.52,48.73 Q49.2 6.03,45.11 6.03,43.33 C35.2
N$2
  Top 0.406: U$5.24 12.14,49.12 9.52,46.51 Q49.1 9.52,42.06 8.57,41.11 C36.2
N$3  (via drill 0.61)
  Top 0.406: D9.C 188.59,44.28 188.27,43.97 188.27,42.06 | 188.27,42.06 D1.C | 188.27,39.84 188.27,42.06 | 188.27,39.84 v188.27,36.35 188.49,36.13 R3.2 | 188.27,39.84 D2.C | v184.78,20.15 SJ2.1
  Bottom 0.406: v188.27,36.35 190.18,34.44 190.18,23.65 186.69,20.15 v184.78,20.15
N$4
  Top 0.406: U$5.54 30.22,46.76 33.02,43.97 33.02,38.57 40.32,31.27 40.32,16.98 37.05,13.72 X4.1
N$5
  Top 0.406: U$5.55 30.7,47.55 33.97,44.28 33.97,38.89 41.27,31.58 41.27,16.66 39.8,15.19 X4.2
N$6
  Top 0.406: U$5.56 31.19,48.34 34.92,44.6 34.92,39.2 42.22,31.9 42.22,12.85 X4.3
N$7  (via drill 0.61, 0.81)
  Top 0.406: U$5.27 17.39,46.76 18.09,47.46 18.09,50.32 v17.14,51.27 | v73.02,4.28 IC11.4
  Bottom 0.406: v17.14,51.27 15.24,51.27 4.12,40.16 4.12,21.42 13.33,12.22 24.12,12.22 30.16,6.18 50.8,6.18 54.61,2.38 U$7.3 64.13,4.28 v73.02,4.28
  other vias: 62.23,2.38
N$8  (via drill 0.61)
  Top 0.406: D10.C 127.95,12.85 128.27,13.17 S5.4 128.27,16.03 v136.2,23.96
  Bottom 0.406: S5.3 128.9,23.96 v136.2,23.96
N$9  (via drill 0.61)
  Top 0.406: U$5.11 18.98,57.56 20,58.57 39.68,58.57 40.95,57.3 40.95,53.17 41.59,52.54 89.21,52.54 93.97,47.78 93.97,37.94 113.98,17.93 v113.98,11.58 | IC4.14 149.54,21.74 149.06,21.27 145.89,21.27 144.78,20.15 v144.78,15.39
  Bottom 0.406: v113.98,11.58 117.47,11.58 121.6,7.46 127.95,7.46 130.49,10 130.49,12.85 133.03,15.39 v144.78,15.39
N$10  (via drill 0.61)
  Top 0.406: IC9.2 136.52,25.87 129.22,18.57 118.74,18.57 115.88,21.42 v115.88,22.38 | v96.52,36.98 v111.12,22.38 | IC8.9 58.1,35.39 v59.05,35.39
  Bottom 0.406: v59.05,35.39 59.37,35.71 85.08,35.71 86.99,37.62 95.88,37.62 v96.52,36.98 | v111.12,22.38 v115.88,22.38
N$11
  Top 0.406: IC6.7 166.37,30.79 166.68,31.11 169.54,31.11 172.08,33.65 172.08,49.37 170.17,51.27 R10.1
N$12  (via drill 0.61)
  Top 0.406: v50.16,21.74 50.48,22.06 IC8.2 | IC6.9 167.63,37.3 167.32,37.62 v167.32,41.11 | v155.89,39.84 148.59,39.84 146.04,37.3 146.04,33.49 145.09,32.54 145.09,24.28 141.28,20.47 141.28,14.44 142.55,13.17 142.55,11.9 141.28,10.63 v141.28,6.5
  Bottom 0.406: v50.16,21.74 50.16,21.42 58.41,13.17 58.41,9.04 61.27,6.18 75.88,6.18 76.83,7.14 103.82,7.14 106.04,9.36 118.42,9.36 121.28,6.5 v141.28,6.5 | v167.32,41.11 166.05,39.84 v155.89,39.84
N$13  (via drill 0.61)
  Top 0.406: IC8.4 v53.02,24.6 53.02,21.11 v53.97,20.15 | IC1.1 60.64,26.5 59.37,26.5 58.1,25.23 v58.1,23.96 | v93.66,12.54 93.66,11.27 96.2,8.73 100.96,8.73 104.77,12.54 D4.A
  Bottom 0.406: v53.02,24.6 53.65,23.96 v58.1,23.96 | v93.66,12.54 88.26,12.54 86.99,11.27 61.59,11.27 53.97,18.88 v53.97,20.15
N$14  (via drill 0.61)
  Top 0.406: v54.29,25.55 IC8.5 | IC1.2 61.91,26.5 v60.64,25.23 60.64,24.6 58.41,22.38 58.41,17.61 59.37,16.66 v59.37,11.58 | D5.A 97.26,11.38 v97.15,11.27
  Bottom 0.406: v60.64,25.23 54.61,25.23 v54.29,25.55 | v97.15,11.27 94.93,9.04 63.81,9.04 63.5,8.73 61.27,8.73 59.37,10.63 v59.37,11.58
N$15  (via drill 0.61)
  Top 0.406: v55.56,20.15 IC8.6 | 63.18,27.77 IC1.3 63.18,26.19 64.45,24.92 v64.45,20.15 64.45,18.25 65.4,17.3 v65.4,10 | v86.67,10 88.26,10 88.58,9.68 D6.A 88.58,8.41
  Bottom 0.406: v64.45,20.15 v55.56,20.15 | v65.4,10 v86.67,10
N$16  (via drill 0.61)
  Top 0.406: v56.83,19.2 IC8.7 | v65.4,19.2 65.4,25.23 64.45,26.19 IC1.4 64.45,27.77 | v89.21,14.44 91.12,16.34 94.29,16.34 95.88,14.76 95.88,10.63 96.52,10 98.1,10 99.05,10.95 99.05,11.9 101.91,14.76 D7.A
  Bottom 0.406: v56.83,19.2 v65.4,19.2 66.35,20.15 76.83,20.15 80,16.98 80,16.03 83.5,12.54 86.99,12.54 88.89,14.44 v89.21,14.44
N$17
  Top 0.406: 24.76,14.54 R20.2 26.35,13.27 26.35,10.31 26.03,10 24.76,10 IC5.5
N$18  (via drill 0.61)
  Top 0.406: v10.16,56.35 10.16,52.22 2.22,44.28 2.22,14.76 1.27,13.81 1.27,10.31 2.22,9.36 7.93,9.36 16.19,1.1 24.44,1.1 24.75,1.41 IC5.4 | U$5.14 16.62,53.29 v16.5,53.17
  Bottom 0.406: v16.5,53.17 16.5,54.13 15.87,54.76 10.79,54.76 10.16,55.4 v10.16,56.35
N$19  (via drill 0.61)
  Top 0.406: IC4.1 v147,19.52 | v170.49,21.11 IC2.11
  Bottom 0.406: v147,19.52 148.59,21.11 v170.49,21.11
N$20
  Top 0.406: S23.4 S23.3 109.53,14.44 109.96,14.01 D4.C
N$21
  Top 0.406: 93.86,28.41 D5.C | S20.4 93.86,28.41 | 93.86,28.41 S20.3
N$22
  Top 0.406: U$5.57 31.67,49.12 35.87,44.92 35.87,39.52 43.18,32.22 43.18,14.76 45.4,12.54 45.4,12.65 X4.4
N$23  (via drill 0.61)
  Top 0.406: U$5.5 23.71,52.96 v24.12,52.54 | v78.73,51.27 78.73,35.39 81.59,32.54 81.59,17.93 v82.23,17.3 | v173.98,19.84 172.72,19.84 171.76,20.79 IC2.10
  Bottom 0.406: v24.12,52.54 28.89,52.54 30.79,50.63 68.26,50.63 68.89,51.27 v78.73,51.27 | v82.23,17.3 171.44,17.3 v173.98,19.84
N$24
  Top 0.406: U$5.58 32.15,49.91 36.83,45.24 36.83,39.84 44.13,32.54 44.13,15.39 45.4,14.12 46.44,14.12 X4.5
N$25  (via drill 0.61)
  Top 0.406: v66.67,8.09 66.67,20.47 66.35,20.79 66.35,25.55 65.72,26.19 IC1.5 65.72,30 64.29,31.43 53.18,31.43 51.75,32.85 IC8.14 | 122.87,12.85 D10.A v119.38,12.85
  Bottom 0.406: v66.67,8.09 103.5,8.09 108.26,12.85 v119.38,12.85
N$26  (via drill 0.61)
  Top 0.406: IC3.12 v152.08,37.62 | D9.A 186.57,43.65 v185.1,43.65
  Bottom 0.406: v152.08,37.62 154.3,37.62 155.57,38.89 170.81,38.89 177.79,45.87 182.88,45.87 v185.1,43.65
N$27  (via drill 0.61)
  Top 0.406: U$5.60 35.97,51.49 38.73,48.73 38.73,40.48 46.03,33.17 v46.03,22.38
  Bottom 0.406: SJ4.1 42.86,15.08 46.03,18.25 v46.03,22.38
N$28
  Top 0.406: U$5.59 35.49,50.7 37.78,48.41 37.78,40.16 45.08,32.85 45.08,15.71 45.72,15.08 47.62,15.08 49.53,13.17 49.53,11.27 48.26,10 X4.9
N$29
  Top 0.406: R11.1 161.28,38.38 IC6.14
N$30  (via drill 0.61)
  Top 0.406: IC8.13 53.02,33.17 53.97,32.22 64.77,32.22 66.99,30 IC1.6 66.99,26.19 67.3,25.87 67.3,21.11 67.62,20.79 v67.62,18.88 | v79.05,16.34 80.32,15.08 81.59,15.08 87.42,20.9 D11.A
  Bottom 0.406: v67.62,18.88 76.51,18.88 v79.05,16.34
N$31  (via drill 0.61)
  Top 0.406: R19.1 v78.73,28.41 | Q1.B 109.05,27.31 v107.94,28.41
  Bottom 0.406: v78.73,28.41 87.94,28.41 89.21,27.14 106.67,27.14 v107.94,28.41
N$32
  Top 0.406: S21.3 90.48,5.55 90.05,5.12 D6.C
  Bottom 0.406: S21.3 94.29,10.63 96.2,12.54 98.74,12.54 S21.4
N$33  (via drill 0.61)
  Top 0.406: IC8.12 54.29,33.65 54.92,33.01 65.24,33.01 68.26,30 IC1.7 68.26,21.42 68.89,20.79 v68.89,17.61 | D12.A 60.32,17.61 v62.23,17.61
  Bottom 0.406: v62.23,17.61 v68.89,17.61
N$34
  Top 0.406: IC8.11 55.56,34.12 55.88,33.81 65.72,33.81 69.53,30 IC1.8 69.53,27.46
N$35  (via drill 0.61)
  Top 0.406: IC10.1 120.96,26.82 120.01,26.82 119.06,25.87 v119.06,23.01 | v139.06,22.06 IC9.4
  Bottom 0.406: v119.06,23.01 120.01,22.06 v139.06,22.06
N$36  (via drill 0.61)
  Top 0.406: v122.23,23.01 IC10.2 | v140.33,23.01 IC9.5
  Bottom 0.406: v122.23,23.01 v140.33,23.01
N$37
  Top 0.406: Q1.C C5.+
N$38  (via drill 0.61)
  Top 0.406: v38.41,56.67 38.41,53.17 40.95,50.63 69.53,50.63 70.8,49.37 70.8,40.16 71.75,39.2 73.34,39.2 75.56,36.98 75.56,36.03 78.73,32.85 R19.2 | U$5.15 15.83,57.66 15.55,57.94 14.28,57.94 v13.97,57.62
  Bottom 0.406: v13.97,57.62 16.82,57.62 17.46,56.98 18.73,56.98 19.36,57.62 37.46,57.62 v38.41,56.67
N$39  (via drill 0.61)
  Top 0.406: U$5.4 24.49,54.08 v24.76,53.81 | v80.64,51.27 81.27,50.63 81.27,44.92 80.32,43.97 80.32,35.08 82.55,32.85 82.55,18.88 v83.18,18.25 | v173.03,21.11 IC2.9
  Bottom 0.406: v24.76,53.81 28.89,53.81 31.11,51.59 67.94,51.59 68.57,52.22 79.69,52.22 v80.64,51.27 | v83.18,18.25 171.13,18.25 173.03,20.15 v173.03,21.11
N$40
  Top 0.406: C38.1 169.22,14.76 IC2.5
N$41
  Top 0.406: C38.2 167.95,14.76 IC2.4
N$42
  Top 0.406: IC2.3 166.68,16.34 166.37,16.03 166.37,14.76 C37.1
N$43
  Top 0.406: C37.2 164.14,14.76 IC2.1
N$44
  Top 0.406: IC2.6 170.49,16.34 170.81,16.03 170.81,14.76 C39.2
N$45
  Top 0.406: IC2.2 165.41,19.52 164.78,20.15 162.24,20.15 C40.1
N$46  (via drill 0.61)
  Top 0.406: IC2.13 167.95,25.23 168.59,25.87 173.67,25.87 175.25,24.28 v175.25,20.79
  Bottom 0.406: X3.3 148.9,14.76 155.89,14.76 156.52,15.39 173.98,15.39 175.57,16.98 175.57,19.52 175.25,19.84 v175.25,20.79
N$47  (via drill 0.61)
  Top 0.406: IC2.14 166.68,25.23 168.27,26.82 173.98,26.82 176.53,24.28 v176.53,18.57
  Bottom 0.406: X3.2 150.69,13.81 156.2,13.81 156.84,14.44 174.3,14.44 176.53,16.66 v176.53,18.57
N$48  (via drill 0.61)
  Top 0.406: v171.13,19.84 171.76,19.2 IC2.7 | v160.33,19.2 154.62,13.49 v154.62,8.41
  Bottom 0.406: v160.33,19.2 170.49,19.2 v171.13,19.84 | X3.7 149.64,8.41 v154.62,8.41
N$49  (via drill 0.61)
  Top 0.406: IC2.8 173.03,18.57 v174.62,18.57 | v159.06,16.34 155.57,12.85 v155.57,7.46
  Bottom 0.406: v174.62,18.57 172.4,16.34 v159.06,16.34 | X3.8 147.85,7.46 v155.57,7.46
N$50
  Top 0.406: 99.37,21.22 D7.C | 99.37,21.22 S24.3 | S24.4 99.37,21.22
N$51  (via drill 0.61)
  Top 0.406: C5.- 113.99,35.41 116.83,38.25 116.83,45.87 v118.1,47.14
  Bottom 0.406: v118.1,47.14 150.49,47.14 153.66,50.32 181.92,50.32 183.19,49.05 187.32,49.05 JP1.1
N$52
  Top 0.406: S22.3 88.26,24.6 91.12,21.74 91.12,17.93 90.8,17.61 89.21,17.61 | S22.4 86.67,16.98 87.31,17.61 89.21,17.61 | 89.21,17.61 D11.C
N$53
  Top 0.406: 62.86,22.06 S6.4 | D12.C 60.32,22.06 62.86,22.06 | S6.3 63.5,15.08 63.5,18.88 62.86,19.52 62.86,22.06
N$54
  Bottom 0.406: X4.6 38.43,15.08 SJ4.2
N$55
  Top 0.406: IC17.2 8.25,13.17 7.93,13.49 5.39,13.49 U4.1
N$56
  Top 0.406: IC17.1 6.98,10.95 U4.2
N$57
  Top 0.406: G1.+ 11.43,7.46 9.52,9.36 IC17.3
N$58  (via drill 0.61)
  Top 0.406: IC17.5 11.96,17.51 v12.06,17.61 | U$5.26 16.59,47.55 v17.14,48.09
  Bottom 0.406: v12.06,17.61 9.2,17.61 6.34,20.47 6.34,38.89 15.55,48.09 v17.14,48.09
N$59  (via drill 0.61)
  Top 0.406: IC17.6 9.52,18.88 v8.89,19.52 | U$5.25 15.79,48.34 16.5,49.05 v16.5,49.37
  Bottom 0.406: v8.89,19.52 7.3,21.11 7.3,38.57 14.6,45.87 16.82,45.87 18.09,47.14 18.09,48.73 17.46,49.37 v16.5,49.37
N$60  (via drill 0.61)
  Top 0.406: v34.29,19.2 IC12.19 | v17.14,19.2 16.5,19.2 15.87,19.84 IC14.10
  Bottom 0.406: v17.14,19.2 32.06,19.2 32.38,18.88 33.97,18.88 v34.29,19.2
N$61  (via drill 0.61)
  Top 0.406: v33.02,20.15 IC12.18 | v14.6,19.52 IC14.9
  Bottom 0.406: v14.6,19.52 14.6,19.84 15.24,20.47 32.7,20.47 v33.02,20.15
N$62  (via drill 0.61)
  Top 0.406: v31.74,27.14 IC12.17 | v14.28,26.19 14.28,24.28 13.33,23.33 IC14.8
  Bottom 0.406: v14.28,26.19 23.81,26.19 24.76,27.14 v31.74,27.14
N$63  (via drill 0.61)
  Top 0.406: U$5.3 25.28,55.19 v25.71,54.76 | v82.23,51.27 82.23,44.6 81.27,43.65 81.27,35.39 83.5,33.17 83.5,19.84 v84.13,19.2 | v143.82,19.2 143.82,20.47 145.41,22.06 147.95,22.06 148.27,22.38 IC4.15
  Bottom 0.406: v25.71,54.76 29.2,54.76 31.43,52.54 67.62,52.54 68.26,53.17 80.32,53.17 v82.23,51.27 | v84.13,19.2 v143.82,19.2
N$64
  Top 0.406: C1.2 152.71,26.5 152.71,27.46 153.35,28.09 IC3.6
N$65  (via drill 0.61)
  Top 0.406: 154.62,27.14 IC3.7 | v155.57,27.14 154.62,27.14 | R16.1 148.16,27.14 v149.85,27.14 | C1.1 154.62,26.5 154.62,27.14
  Bottom 0.406: v149.85,27.14 v155.57,27.14
N$66  (via drill 0.61)
  Top 0.406: U$5.2 26.07,57.34 26.35,57.62 39.05,57.62 40,56.67 40,52.86 41.27,51.59 71.75,51.59 73.66,49.68 73.66,40.16 76.51,37.3 76.51,36.35 80.64,32.22 80.64,16.98 v81.27,16.34 | v150.81,15.71 IC4.4
  Bottom 0.406: v81.27,16.34 150.17,16.34 v150.81,15.71
N$67  (via drill 0.61)
  Top 0.406: IC4.3 149.54,19.2 149.85,19.52 152.71,19.52 v153.35,20.15 | v169.22,20.15 IC2.12
  Bottom 0.406: v153.35,20.15 v169.22,20.15
N$68
  Top 0.406: IC4.5 152.08,15.08 153.66,13.49 153.66,7.46 155.57,5.55 175.89,5.55 176.53,6.18 176.53,8.09 SV4.1
N$69  (via drill 0.61)
  Top 0.406: v123.5,24.28 IC10.3 | v141.6,26.5 IC9.6
  Bottom 0.406: v123.5,24.28 125.41,24.28 127.63,26.5 v141.6,26.5
N$70  (via drill 0.61)
  Top 0.406: v124.77,25.23 IC10.4 | v142.87,27.14 IC9.7
  Bottom 0.406: v124.77,25.23 126.99,27.46 142.55,27.46 v142.87,27.14
N$71
  Top 0.406: IC9.14 137.79,34.12 137.47,33.81 129.53,33.81 126.04,30.31 IC10.5 126.04,27.14
N$72  (via drill 0.61)
  Top 0.406: v144.14,6.5 144.14,10.79 145.33,11.98 145.33,13.73 145.73,14.12 145.73,19.84 146.36,20.47 152.08,20.47 153.35,21.74 153.35,22.06 | 153.35,22.06 IC4.11 | 153.35,22.06 154.62,22.06 | 154.62,22.06 155.89,22.06 IC4.9 | 154.62,22.06 IC4.10
  Bottom 0.406: v144.14,6.5 162.56,6.5 167,10.95 173.67,10.95 SV4.3
N$73  (via drill 0.61)
  Top 0.406: 67.94,9.68 IC11.8 v67.94,12.54 | v79.37,12.54 79.37,9.36 80,8.73 82.23,8.73 R17.2
  Bottom 0.406: v67.94,12.54 v79.37,12.54
N$74  (via drill 0.61)
  Top 0.406: v152.08,22.06 IC4.12 | v178.43,18.57 178.43,13.17 176.21,10.95 171.76,10.95 SV4.7
  Bottom 0.406: v152.08,22.06 175.89,22.06 178.43,19.52 v178.43,18.57
N$75  (via drill 0.61)
  Top 0.406: v146.68,5.55 146.68,10.55 148.03,11.9 148.03,13.88 148.27,14.12 IC4.2
  Bottom 0.406: SV4.9 163.82,5.55 v146.68,5.55
N$76
  Top 0.406: U$5.1 26.99,56.35 R21.2
N$77  (via drill 0.61)
  Top 0.406: v187.64,28.41 SJ3.2 | v181.29,32.22 178.75,32.22 178.11,32.85 IC7.15
  Bottom 0.406: v181.29,32.22 183.83,32.22 v187.64,28.41
N$78  (via drill 0.61)
  Top 0.406: U$5.61 27.67,52.27 27.3,51.91 27.3,51.59 26.35,50.63 v26.35,47.14 | v46.98,29.68 46.98,21.42 46.35,20.79 R1.1 R4.2
  Bottom 0.406: v26.35,47.14 27.93,47.14 45.4,29.68 v46.98,29.68
N$79  (via drill 0.61)
  Top 0.406: IC7.13 175.57,30.63 176.21,30 v181.29,30 | v184.78,24.92 187.32,24.92 187.64,24.6 SJ1.2
  Bottom 0.406: v184.78,24.92 184.78,28.41 183.19,30 v181.29,30
N$81
  Top 0.406: 189.22,20.15 190.18,20.15 190.5,20.47 190.5,30.31 | 190.5,30.31 190.5,35.71 189.97,36.23 D8.A | 190.5,30.31 R5.1 | 189.22,20.15 SJ2.3 | D3.A 189.22,17.61 189.22,20.15
N$88
  Top 0.406: IC9.13 139.06,34.12 137.95,33.01 130.01,33.01 127.31,30.31 IC10.6
N$89
  Top 0.406: IC9.12 140.33,34.12 138.27,32.06 130.33,32.06 128.58,30.31 IC10.7
N$90
  Top 0.406: IC9.11 141.6,34.12 138.74,31.27 130.81,31.27 129.85,30.31 IC10.8
N$96  (via drill 0.61)
  Top 0.406: U$5.28 18.63,45.97 v19.68,44.92 | v47.94,28.41 47.94,22.38 50.8,19.52 v50.8,9.68 | IC11.6 70.48,5.87 69.84,5.23 58.73,5.23 v57.46,6.5
  Bottom 0.406: v19.68,44.92 20.63,43.97 29.52,43.97 45.08,28.41 v47.94,28.41 | v50.8,9.68 53.97,6.5 v57.46,6.5
N$110  (via drill 0.61)
  Top 0.406: v30.47,24.6 IC12.16 | v12.06,19.52 IC14.7
  Bottom 0.406: v30.47,24.6 30.47,23.96 27.93,21.42 13.97,21.42 v12.06,19.52
N$111  (via drill 0.61)
  Top 0.406: v29.2,24.6 IC12.15 | v10.79,19.52 IC14.6
  Bottom 0.406: v29.2,24.6 29.2,23.96 27.62,22.38 12.7,22.38 10.79,20.47 v10.79,19.52
N$112  (via drill 0.61)
  Top 0.406: v27.93,24.6 IC12.14 | IC14.5 v9.52,23.96
  Bottom 0.406: v27.93,24.6 27.93,23.96 27.3,23.33 10.16,23.33 v9.52,23.96
N$113  (via drill 0.61)
  Top 0.406: v26.66,24.6 IC12.13 | v12.7,24.6 12.06,25.23 8.89,25.23 8.25,24.6 IC14.4
  Bottom 0.406: v12.7,24.6 13.01,24.28 26.35,24.28 v26.66,24.6
N$114  (via drill 0.61)
  Top 0.406: v25.39,25.55 IC12.12 | v12.7,26.19 8.25,26.19 6.98,24.92 IC14.3
  Bottom 0.406: v12.7,26.19 13.65,25.23 25.08,25.23 v25.39,25.55
N$116  (via drill 0.61)
  Top 0.406: IC12.11 24.12,24.6 22.54,26.19 v22.54,27.46 | U$5.43 22.92,37.05 v22.54,36.66
  Bottom 0.406: v22.54,36.66 15.87,30 15.87,28.09 16.82,27.14 22.22,27.14 v22.54,27.46
N$117  (via drill 0.61)
  Top 0.406: IC14.22 12.06,31.9 v10.79,30.63 | U$5.34 15.83,39.88 15.87,39.84 14.92,38.89 v13.97,38.89
  Bottom 0.406: v10.79,30.63 10.79,35.71 v13.97,38.89
N$118
  Top 0.406: IC14.27 5.71,34.76 10.16,39.2 12.7,39.2 14.46,40.97 U$5.33
N$230
  Top 0.406: IC6.4 162.56,32.06 164.46,33.97 168.59,33.97 169.22,34.6 169.22,38.38 R7.1
N$231
  Top 0.406: IC6.5 163.82,31.74 165.09,33.01 168.91,33.01 170.17,34.28 170.17,42.7 169.86,43.02 R8.1
N$232
  Top 0.406: IC6.6 165.09,31.11 166.05,32.06 169.22,32.06 171.13,33.97 171.13,46.19 170.17,47.14 R9.1
N$235
  Top 0.406: R12.1 162.24,43.02 162.56,42.7 IC6.13
N$236
  Top 0.406: IC6.12 163.82,36.98 163.51,37.3 163.51,45.87 162.24,47.14 R13.1
N$237
  Top 0.406: IC6.11 165.09,36.98 164.46,37.62 164.46,49.05 162.24,51.27 R14.1
PB7  (via drill 0.61)
  Top 0.406: v49.84,3.96 51.75,5.87 51.75,14.44 53.34,16.03 v58.41,16.03 | S24.1 89.21,27.14 89.21,34.76 S20.2 | S20.1 100.64,34.12 110.17,24.6 S23.2 113.02,23.65 113.02,20.47 114.93,18.57 v114.93,14.44 | S22.2 80.96,12.54 89.85,12.54 S24.2 92.39,13.81 92.39,3.01 | R2.2 112.07,11.05 S23.1 | S6.1 S6.2 | 92.39,3.01 S21.1 | 92.39,3.01 S21.2 | U$5.17 14.41,54.64 v15.24,53.81
  Bottom 0.406: v49.84,3.96 29.2,3.96 22.86,10.31 12.7,10.31 2.22,20.79 2.22,44.28 11.74,53.81 v15.24,53.81 | v58.41,16.03 68.89,16.03 S6.1 S22.2 79.37,14.44 | S23.2 S5.1 | S6.2 S22.1 84.45,24.6 86.04,26.19 87.62,26.19 89.21,24.6 S24.1 | S23.1 v114.93,14.44 S5.2 | S20.2 S20.1
PD4  (via drill 0.61)
  Top 0.406: U$5.29 16.24,45.19 v18.09,43.33 | v176.84,31.27 IC7.14
  Bottom 0.406: v18.09,43.33 18.41,43.02 29.2,43.02 44.76,27.46 56.83,27.46 57.78,28.41 71.43,28.41 72.7,29.68 109.53,29.68 111.12,31.27 136.52,31.27 137.79,32.54 147.63,32.54 148.9,31.27 v176.84,31.27
PD5  (via drill 0.61)
  Top 0.406: U$5.30 15.12,44.4 v16.82,42.7 | v184.78,23.33 SJ1.1
  Bottom 0.406: v16.82,42.7 17.46,42.06 28.89,42.06 44.45,26.5 56.83,26.5 57.15,26.19 73.66,26.19 74.61,27.14 87.94,27.14 88.89,26.19 107.31,26.19 111.44,30.31 175.89,30.31 177.16,29.04 182.88,29.04 183.83,28.09 183.83,24.28 v184.78,23.33
PD6  (via drill 0.61)
  Top 0.406: U$5.31 14.32,43.61 v15.24,42.7 | 174.3,36.35 v174.3,29.36 175.25,29.36 178.43,26.19 v178.43,22.7 | 174.3,36.35 IC7.12 | 174.3,36.35 174.3,37.94 176.21,39.84 D2.A | D3.C 185.94,18.57 184.78,18.57 183.19,20.15 v180.97,20.15
  Bottom 0.406: v15.24,42.7 15.24,42.38 16.5,41.11 28.57,41.11 44.13,25.55 50.48,25.55 53.02,23.01 105.41,23.01 111.75,29.36 v174.3,29.36 | v178.43,22.7 v180.97,20.15
PD7  (via drill 0.61)
  Top 0.406: U$5.32 13.06,42.7 12.7,42.7 12.06,42.06 v12.06,40.48 | v173.03,28.41 173.03,36.35 | 173.03,36.35 IC7.11 | 173.03,36.35 173.03,38.25 176.84,42.06 D1.A
  Bottom 0.406: v173.03,28.41 112.07,28.41 105.72,22.06 52.7,22.06 50.16,24.6 43.81,24.6 28.25,40.16 12.38,40.16 v12.06,40.48
PE4  (via drill 0.61)
  Top 0.406: v181.92,34.44 IC7.18 | U$5.6 22.92,51.33 v22.86,51.27
  Bottom 0.406: v22.86,51.27 28.89,51.27 46.35,33.81 48.26,33.81 49.84,32.22 70.16,32.22 71.43,33.49 108.26,33.49 109.85,35.08 135.25,35.08 136.52,36.35 148.9,36.35 150.17,35.08 181.29,35.08 v181.92,34.44
PE5  (via drill 0.61)
  Top 0.406: U$5.7 22.13,52.77 21.9,52.54 v21.9,50.32 | v180.65,34.12 IC7.17
  Bottom 0.406: v21.9,50.32 28.57,50.32 46.03,32.85 47.94,32.85 49.53,31.27 70.48,31.27 71.75,32.54 108.58,32.54 110.17,34.12 135.57,34.12 136.84,35.39 148.59,35.39 149.85,34.12 v180.65,34.12
PE6  (via drill 0.61)
  Top 0.406: U$5.8 21.34,53.25 20.95,52.86 v20.95,49.37 | v179.38,33.17 IC7.16
  Bottom 0.406: v20.95,49.37 28.25,49.37 45.72,31.9 47.62,31.9 49.21,30.31 70.8,30.31 72.07,31.58 108.9,31.58 110.48,33.17 135.88,33.17 137.16,34.44 148.27,34.44 149.54,33.17 v179.38,33.17
PE7  (via drill 0.61)
  Top 0.406: U$5.9 20.56,53.42 20,52.86 v20,48.41 | SJ3.1 186.11,28.35 v186.05,28.41
  Bottom 0.406: v20,48.41 27.93,48.41 45.4,30.95 47.3,30.95 48.89,29.36 71.11,29.36 72.38,30.63 109.21,30.63 110.8,32.22 136.2,32.22 137.47,33.49 147.95,33.49 149.22,32.22 177.48,32.22 v178.43,31.27 183.19,31.27 v186.05,28.41
RED0
  Top 0.406: SV1.2 42.54,57.3 43.81,58.57 176.21,58.57 183.19,51.59 IC7.2
RED1  (via drill 0.61)
  Top 0.406: v180.65,51.27 IC7.4
  Bottom 0.406: SV6.2 140.33,55.08 140.33,52.22 141.28,51.27 v180.65,51.27
RESET\  (via drill 0.61)
  Top 0.406: R18.1 130.38,3.43 v130.81,3.01 | 117.18,2.72 117.15,2.69 | S1.2 117.18,2.72 | IC13.1 117.32,2.86 117.18,2.72 | U$5.20 14.33,52.27 v14.6,52.54 | v32.38,8.41 32.38,6.82 30.79,5.23 v29.52,5.23 24.12,5.23 23.48,4.59 IC5.3
  Bottom 0.406: 117.15,2.69 117.16,2.69 S1.2 | 117.15,2.69 112.39,7.46 106.67,7.46 104.45,5.23 77.46,5.23 75.56,3.33 65.4,3.33 62.86,0.79 54.61,0.79 50.16,5.23 v29.52,5.23 23.49,11.27 13.01,11.27 3.17,21.11 3.17,40.48 11.74,49.05 11.74,49.68 v14.6,52.54 | 117.15,2.69 120.01,2.69 120.33,3.01 v130.81,3.01 144.78,3.01 146.04,1.74 170.81,1.74 171.44,2.38 171.44,8.09 SV4.5 | SJ4.3 35.55,15.08 35.24,14.76 35.24,10 33.65,8.41 v32.38,8.41
SCK  (via drill 0.61)
  Top 0.406: v51.75,16.34 IC8.3 | v137.79,4.6 v137.79,23.96 IC9.3 | v161.28,25.87 IC6.3 | v150.81,25.87 IC4.13 | v180.97,22.7 181.92,21.74 188.91,21.74 189.16,22 SJ1.3 | IC5.2 22.21,5.22 23.17,6.18 27.93,6.18 29.2,7.46 v30.47,7.46
  Bottom 0.406: 49.53,7.14 49.53,14.12 v51.75,16.34 | 49.53,7.14 51.43,7.14 53.34,5.23 76.19,5.23 77.15,6.18 104.13,6.18 106.36,8.41 118.1,8.41 121.6,4.92 137.47,4.92 v137.79,4.6 | v137.79,23.96 144.46,23.96 146.36,25.87 v150.81,25.87 v161.28,25.87 179.7,25.87 180.97,24.6 v180.97,22.7 | v30.47,7.46 30.79,7.14 49.53,7.14
SEGM_L0  (via drill 0.61)
  Top 0.406: v77.46,36.98 LED6.3 | v107.94,38.57 LED7.3 107.94,42.7 106.67,43.97 106.67,49.37 107.31,50 139.69,50 | R7.2 165.73,38.89 v165.73,41.11 | LED8.3 139.69,42.38 139.69,50 | 139.69,50 146.68,50 155.57,41.11 v159.06,41.11
  Bottom 0.406: LED5.3 49.53,41.11 53.65,36.98 v77.46,36.98 85.08,36.98 86.67,38.57 v107.94,38.57 | v159.06,41.11 v165.73,41.11
SEGM_L1  (via drill 0.61)
  Top 0.406: R8.2 165.73,43.2 v165.73,44.92
  Bottom 0.406: LED5.6 57.15,40.16 57.46,39.84 87.62,39.84 | 87.62,39.84 LED6.6 | 118.1,39.84 LED7.6 | 87.62,39.84 118.1,39.84 | 118.1,39.84 148.59,39.84 | 148.59,39.84 154.3,39.84 159.38,44.92 v165.73,44.92 | 148.59,39.84 LED8.6
SEGM_L2  (via drill 0.61)
  Top 0.406: v72.38,44.28 LED6.12 | v102.86,44.28 LED7.12 | v133.34,44.28 LED8.12 | R9.2 165.73,47.33 v165.73,49.05
  Bottom 0.406: LED5.12 46.35,44.28 v72.38,44.28 v102.86,44.28 v133.34,44.28 152.39,44.28 157.16,49.05 v165.73,49.05
SEGM_L3  (via drill 0.61)
  Top 0.406: v82.55,37.94 LED6.4 v82.55,43.33 | v113.02,43.33 LED7.4 | v143.5,43.33 LED8.4 | v167.32,49.05 167.32,49.68 165.92,51.08 R10.2
  Bottom 0.406: LED5.4 52.07,40.16 54.29,37.94 v82.55,37.94 | v82.55,43.33 v113.02,43.33 v143.5,43.33 152.71,43.33 156.52,47.14 166.37,47.14 167.32,48.09 v167.32,49.05
SEGM_L4  (via drill 0.61)
  Top 0.406: v85.08,38.89 LED6.5 87.31,43.33 v87.31,47.46 | v115.56,38.89 LED7.5 115.56,44.6 v113.02,47.14 | v146.04,38.89 LED8.5 | v153.98,38.89 R11.2
  Bottom 0.406: LED5.5 54.61,39.84 55.56,38.89 v85.08,38.89 | v115.56,38.89 v146.04,38.89 v153.98,38.89 | v87.31,47.46 98.74,47.46 102.23,50.95 111.44,50.95 113.02,49.37 v113.02,47.14
SEGM_L5  (via drill 0.61)
  Top 0.406: v155.89,43.02 R12.2
  Bottom 0.406: LED5.2 45.72,42.38 74.92,42.38 | 74.92,42.38 LED6.2 | 105.41,42.38 LED7.2 | 74.92,42.38 105.41,42.38 | 135.88,42.38 LED8.2 | 105.41,42.38 135.88,42.38 | 135.88,42.38 155.25,42.38 v155.89,43.02
SEGM_L6  (via drill 0.61)
  Top 0.406: v74.92,45.24 LED6.11 | v105.41,45.24 LED7.11 | v135.88,45.24 LED8.11 | v153.66,47.14 R13.2
  Bottom 0.406: LED5.11 47.94,45.24 v74.92,45.24 v105.41,45.24 v135.88,45.24 151.76,45.24 v153.66,47.14
SEGM_L7  (via drill 0.61)
  Top 0.406: v80,46.19 LED6.9 | v140.97,46.19 LED8.9 | R14.2 156.2,51.27 v153.66,48.73
  Bottom 0.406: LED5.9 52.07,46.19 v80,46.19 110.48,46.19 | 110.48,46.19 LED7.9 | 110.48,46.19 v140.97,46.19 151.12,46.19 v153.66,48.73
SEL0
  Top 0.406: IC7.8 175.57,50.95 170.81,55.71 153.35,55.71 149.54,51.91 SV3.1
SEL1
  Top 0.406: IC7.9 174.3,50.95 170.49,54.76 153.66,54.76 149.85,50.95 106.99,50.95 106.36,50.32 96.2,50.32 SV3.3
SS  (via drill 0.61)
  Top 0.406: U$5.10 19.77,55.49 v19.36,55.08 | v49.21,23.01 IC8.1 49.21,31.27 39.68,40.79 39.68,49.05 36.51,52.22 v36.51,55.08 | IC9.1 135.25,26.5 v129.85,21.11 | v158.75,23.96 IC6.1
  Bottom 0.406: v19.36,55.08 20,55.71 35.87,55.71 v36.51,55.08 | v49.21,23.01 50.48,23.01 52.38,21.11 v129.85,21.11 145.41,21.11 148.27,23.96 v158.75,23.96

## Text on the board
Top: mathlep
tValues: alternativ gewinkelt